# Altium schematic sheet eGAN-FET-module_Bridge.SchDoc: Модуль инвертора
size 594 x 420 mm; ApprovedBy: Юсупов; CheckedBy: Юсупов; DrawnBy: Подлесный; SheetNumber: 1; SheetTotal: 5; Format: A2; DocumentType: Схема электрическая принципиальная
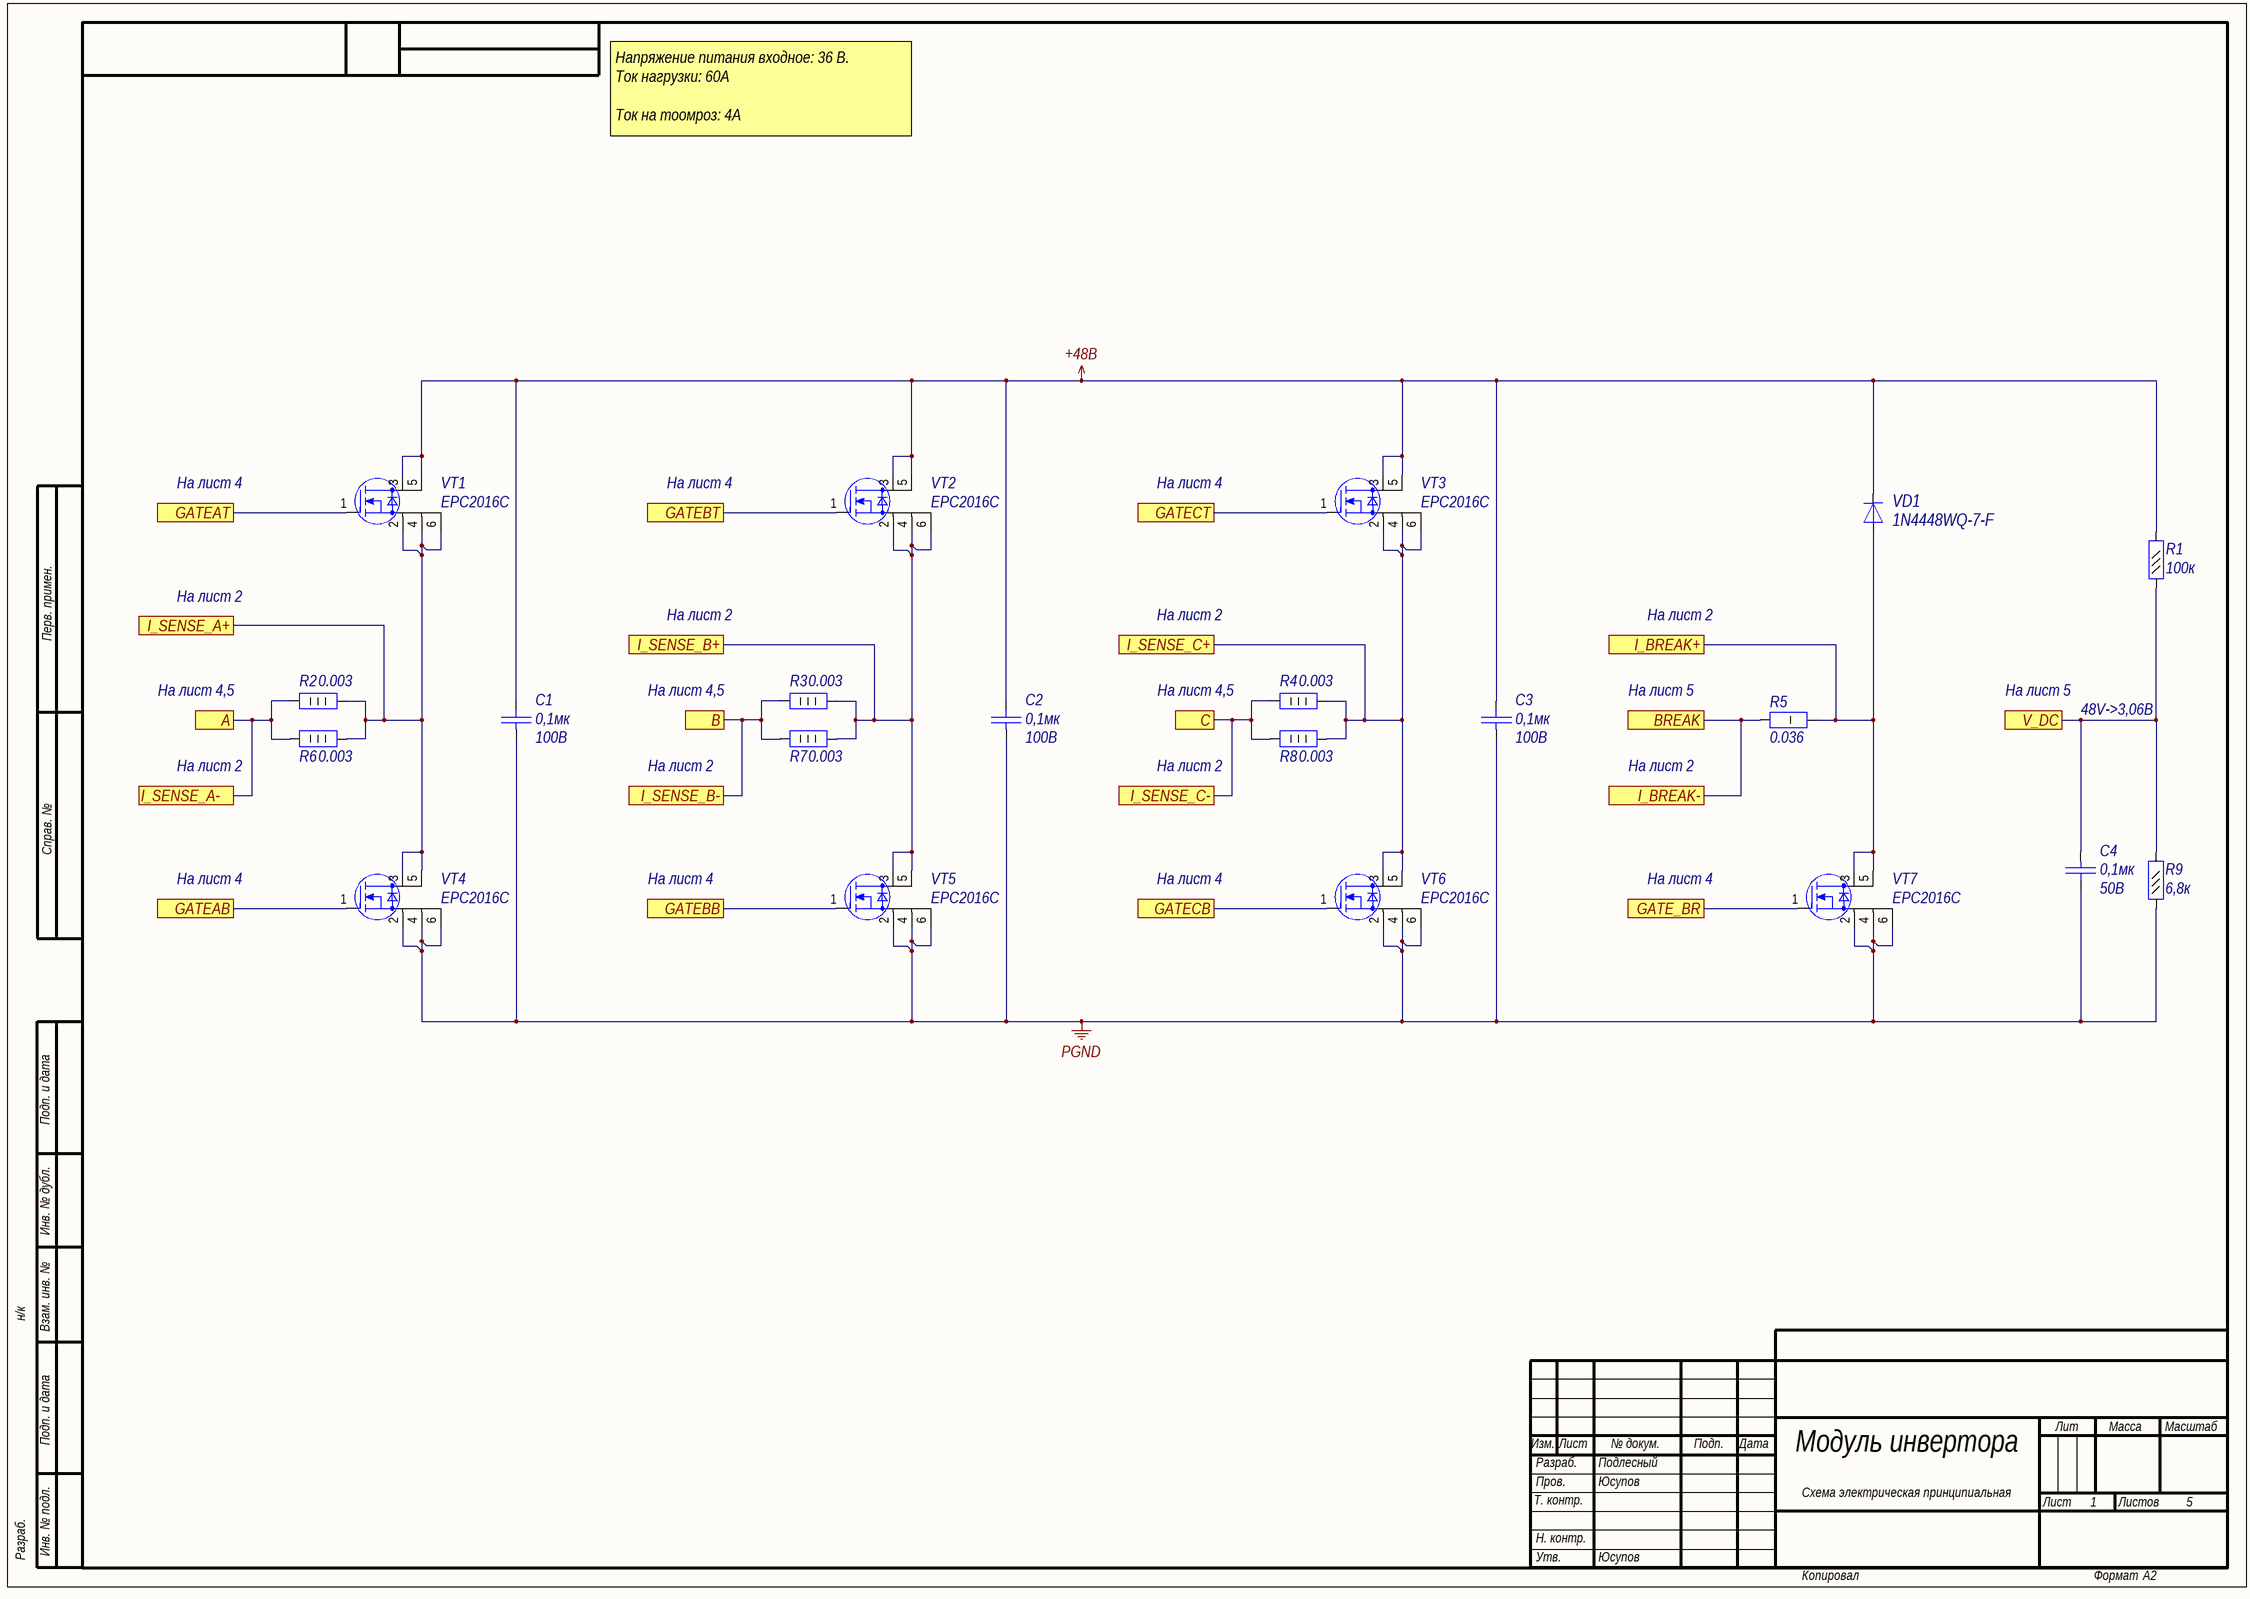
[diagram p0: eGAN-FET-module_Bridge.SchDoc]

## Parts
C1  Voltage: 100В  [C1206]  (hidden comment: 0,1мк)
C2  Voltage: 100В  [C1206]  (hidden comment: 0,1мк)
C3  Voltage: 100В  [C1206]  (hidden comment: 0,1мк)
C4  value 0,1мк  Voltage: 50В  [C0402]  (hidden comment: Capacitor)
R1  value 100к  [R0402]  (hidden comment: Resistor_0,062Вт)
R2  0.003  [R2512]
R3  0.003  [R2512]
R4  0.003  [R2512]
R5  0.036  [R1206]
R6  0.003  [R2512]
R7  0.003  [R2512]
R8  0.003  [R2512]
R9  6,8к  [R0402]
VD1  1N4448WQ-7-F  [SOD-123]
VT1  EPC2016C  [EPC2016C]
VT2  EPC2016C  [EPC2016C]
VT3  EPC2016C  [EPC2016C]
VT4  EPC2016C  [EPC2016C]
VT5  EPC2016C  [EPC2016C]
VT6  EPC2016C  [EPC2016C]
VT7  EPC2016C  [EPC2016C]

## Ports
A, B, BREAK, C, GATE_BR, GATEAB, GATEAT, GATEBB, GATEBT, GATECB, GATECT, I_BREAK+, I_BREAK-, I_SENSE_A+, I_SENSE_A-, I_SENSE_B+, I_SENSE_B-, I_SENSE_C+, I_SENSE_C-, V_DC

## Nets
+48B: C1.2 C2.2 C3.2 R1.2 VD1.1(K) VT1.3(D) VT1.5(D) VT2.3(D) VT2.5(D) VT3.3(D) VT3.5(D)
PGND: C1.1 C2.1 C3.1 C4.2 R9.1 VT4.2(SUBSTRATE) VT4.4(S) VT4.6(S) VT5.2(SUBSTRATE) VT5.4(S) VT5.6(S) VT6.2(SUBSTRATE) VT6.4(S) VT6.6(S) VT7.2(SUBSTRATE) VT7.4(S) VT7.6(S)
A: R2.1 R6.1 ; port A, port I_SENSE_A-
B: R3.1 R7.1 ; port B, port I_SENSE_B-
BREAK: R5.1 ; port BREAK, port I_BREAK-
C: R4.1 R8.1 ; port C, port I_SENSE_C-
GATE_BR: VT7.1(G) ; port GATE_BR
GATEAB: VT4.1(G) ; port GATEAB
GATEAT: VT1.1(G) ; port GATEAT
GATEBB: VT5.1(G) ; port GATEBB
GATEBT: VT2.1(G) ; port GATEBT
GATECB: VT6.1(G) ; port GATECB
GATECT: VT3.1(G) ; port GATECT
I_BREAK+: R5.2 VD1.2(A) VT7.3(D) VT7.5(D) ; port I_BREAK+
I_SENSE_A+: R2.2 R6.2 VT1.2(SUBSTRATE) VT1.4(S) VT1.6(S) VT4.3(D) VT4.5(D) ; port I_SENSE_A+
I_SENSE_B+: R3.2 R7.2 VT2.2(SUBSTRATE) VT2.4(S) VT2.6(S) VT5.3(D) VT5.5(D) ; port I_SENSE_B+
I_SENSE_C+: R4.2 R8.2 VT3.2(SUBSTRATE) VT3.4(S) VT3.6(S) VT6.3(D) VT6.5(D) ; port I_SENSE_C+
V_DC: C4.1 R1.1 R9.2 ; port V_DC

## Notes on the sheet
- Напряжение питания входное: 36 B.
  Ток нагрузки: 60А
  Ток на тоомроз: 4А
- На лист 4
- Перв. примен.
- На лист 2
- На лист 4,5
- (near R4) На лист 4,5
- На лист 5
- 48V->3,06B
- Справ. №
- Подп. и дата
- Инв. № дубл.
- н/к
- Взам. инв. №
- Изм.
- Лист
- № докум.
- Подп.
- Дата
- Лит
- Масса
- Масштаб
- Т. контр.
- Пров.
- Разраб.
- Листов
- Инв. № подл.
- Н. контр.
- Утв.
- Копировал
- Формат

## Library data of the parts
C1-C3 = cap286: Конденсатор; Part Name: Ceramic; Manufacture: Murata; Part Number: GRM31C5C2A104JA01L; id: cap286; TKE: NP0; Value: 0,1мк
C4 = cap277: Конденсатор; Part Name: Ceramic; Manufacture: Murata; Part Number: GRM155R71H104KE14D; id: cap277; TKE: X7R; tga: 0,10%
R1 = res318: Резистор; Manufacture: Yageo; Part Number: RC0402FR-07100KL; id: res318; Accuracy: 0.01; Part Name: Resistor; Power: 0,062Вт
R2-R4 R6-R8 = CRE2512-FZ-R003E-3: Резистор; Part Name: Current Sense Resistors; Manufacture: Bourns; id: shunt11; Accuracy: 0.01; Power: 3Вт; Part Number: CRE2512-FZ-R003E-3; Value: 0.003
R5 = ERJ-8CWFR036V: Резистор; Part Name: Current Sense Resistors; id: shunt12; Accuracy: 0.01; Power: 1Вт; Part Number: ERJ-8CWFR036V; Value: 0.036
R9 = res290: Резистор; Part Name: Resistor; Manufacture: Yageo; Part Number: RC0402FR-076K8; id: res290; Accuracy: 0.01; Power: 0,062Вт; Value: 6,8к
VD1 = diode45: Диод; Part Name: General Purpose Diodes; Manufacture: Diodes Incorporated; Max Reverse Voltage: 100B; Forward Voltage: 1,25B; Forward Current: 4A; Reverse Current: 2,5uA; Reverse Recovery time: 4ns; Capacitance: 4pF; Number: 1; id: diode45; Temp MAX: +150; Temp MIN: -65; Part Number: 1N4448WQ-7-F
VT1-VT7 = mosfert39: eGaN Enhancement Mode Power Transistor; Manufacturer: EPC; Structure: n-channel; V drain-source max: 100B; Rds: 0,016Ohm; Gate-to-source voltage: (+)6/-4; Continuous drain current: 18A; Total gate charge: 4,5nC; Pulsed drain current: 75A; id: mosfert39; Part Number: EPC2016C